# Altium schematic sheet Laboratoire2_MemRTC-I2C-ETU.SchDoc
size Letter; Organization: Cegep Limoilou; Address1: 1300, 8e Avenue; Address2: Québec, QC; Address3: Canada; Address4: G1J 5L5; Revision: A; SheetNumber: 1; SheetTotal: 1; Conception: Conception?; Titre: Laboratoire #2, cours 247-316-LI; Modification: A.C.
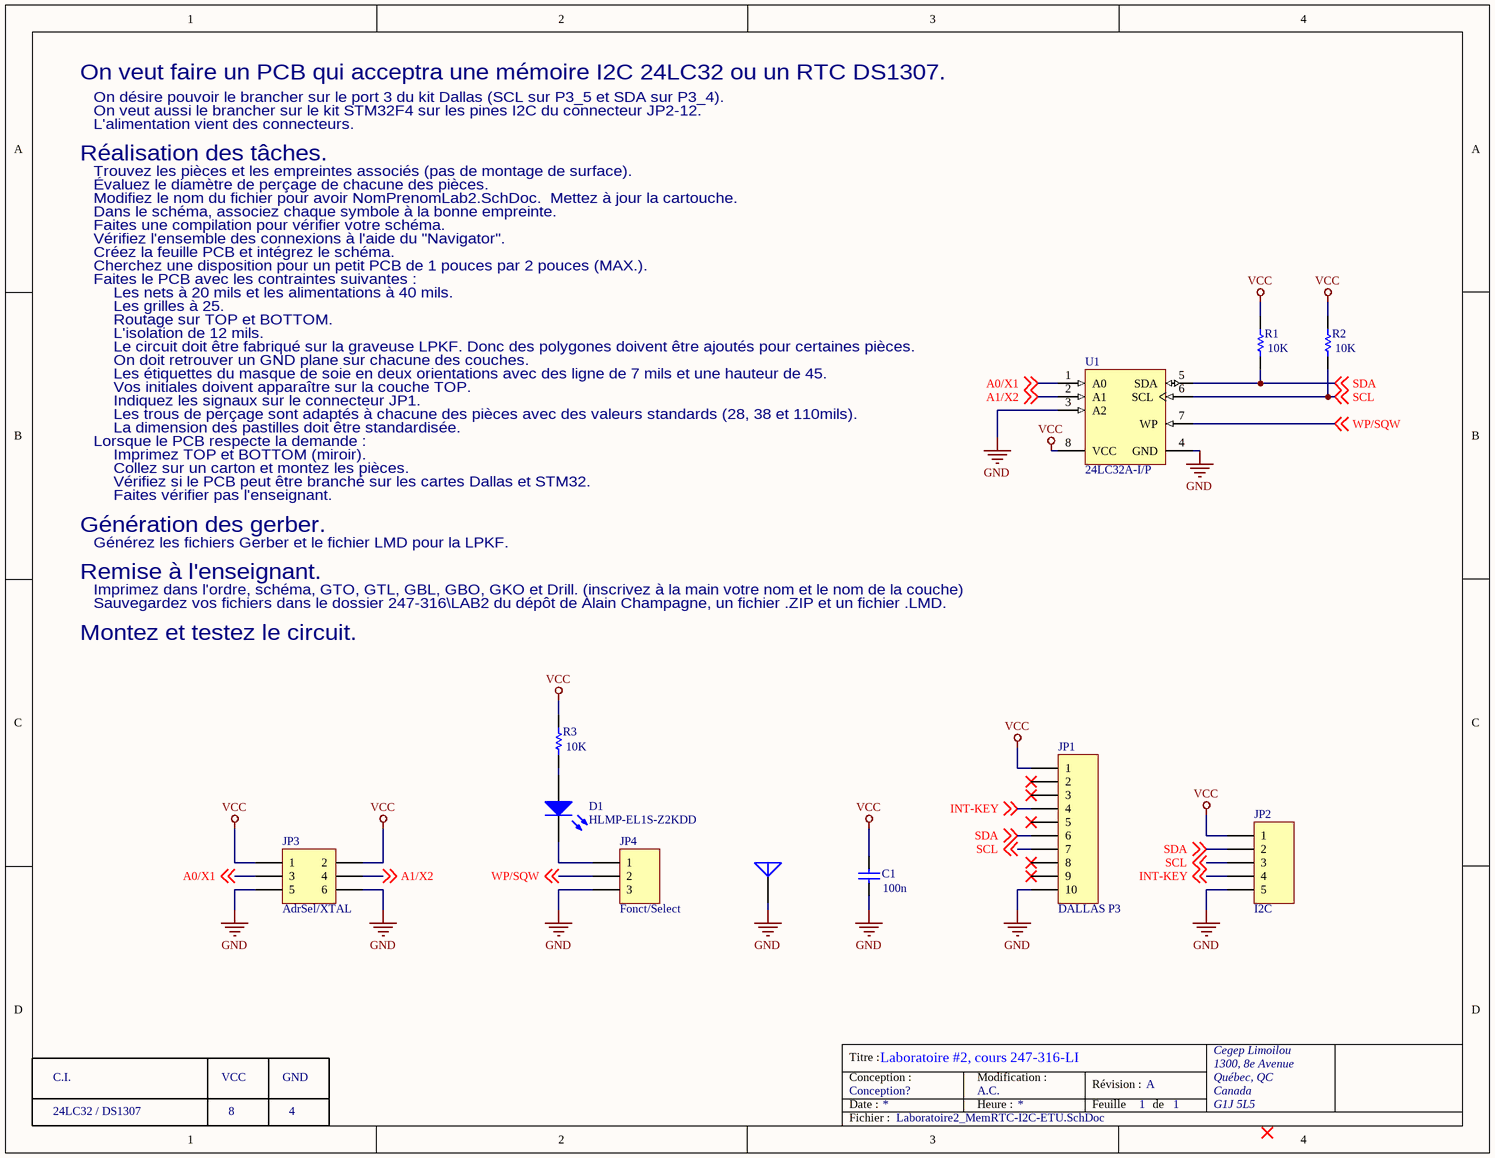
[diagram p0: Laboratoire2_MemRTC-I2C-ETU.SchDoc]

## Parts
C1  100n  [AC100\125_2]
D1  HLMP-EL1S-Z2KDD  [RC100\200+_2]
JP1  DALLAS P3  [SIP\10P_2]
JP2  I2C  [MOLEX5_2]
JP3  AdrSel/XTAL  [J\6P_2]
JP4  Fonct/Select  [SIP\3P_2]
MTH1  Montage  [MTHOLE1]  (value not drawn)
R1  10K  [R400_2]
R2  10K  [R400_2]
R3  10K  [R400_2]
U1  24LC32A-I/P  [DIP8_2]

## Nets
GND: C1.1 JP1.10 JP2.5 JP3.5 JP3.6 JP4.3 MTH1.1(A) U1.3(A2) U1.4(GND)
VCC: C1.2 JP1.1 JP2.1 JP3.1 JP3.2 R1.2 R2.2 R3.2 U1.8(VCC)
A0/X1: JP3.3 U1.1(A0) ; off-sheet A0/X1
A1/X2: JP3.4 U1.2(A1) ; off-sheet A1/X2
INT-KEY: JP1.4 JP2.4 ; off-sheet INT-KEY
SCL: JP1.7 JP2.3 R2.1 U1.6(SCL) ; off-sheet SCL
SDA: JP1.6 JP2.2 R1.1 U1.5(SDA) ; off-sheet SDA
WP/SQW: JP4.2 U1.7(WP) ; off-sheet WP/SQW
NetD1_1: D1.1(A) R3.1
NetD1_2: D1.2(K) JP4.1

Not connected (* = marked no-connect by the designer): JP1 2* 3* 5* 8* 9*

## Notes on the sheet
- On veut faire un PCB qui acceptra une mémoire I2C 24LC32 ou un RTC DS1307.
- On désire pouvoir le brancher sur le port 3 du kit Dallas (SCL sur P3_5 et SDA sur P3_4).
- Réalisation des tâches.
- On veut aussi le brancher sur le kit STM32F4 sur les pines I2C du connecteur JP2-12.
- L'alimentation vient des connecteurs.
- Trouvez les pièces et les empreintes associés (pas de montage de surface).
- Évaluez le diamètre de perçage de chacune des pièces.
- Modifiez le nom du fichier pour avoir NomPrenomLab2.SchDoc.  Mettez à jour la cartouche.
- Dans le schéma, associez chaque symbole à la bonne empreinte.
- Faites une compilation pour vérifier votre schéma.
- Vérifiez l'ensemble des connexions à l'aide du "Navigator".
- Créez la feuille PCB et intégrez le schéma.
- Cherchez une disposition pour un petit PCB de 1 pouces par 2 pouces (MAX.).
- Faites le PCB avec les contraintes suivantes :
- Les nets à 20 mils et les alimentations à 40 mils.
- Les grilles à 25.
- Routage sur TOP et BOTTOM.
- L'isolation de 12 mils.
- Le circuit doit être fabriqué sur la graveuse LPKF. Donc des polygones doivent être ajoutés pour certaines pièces.
- On doit retrouver un GND plane sur chacune des couches.
- Les étiquettes du masque de soie en deux orientations avec des ligne de 7 mils et une hauteur de 45.
- Vos initiales doivent apparaître sur la couche TOP.
- Indiquez les signaux sur le connecteur JP1.
- Les trous de perçage sont adaptés à chacune des pièces avec des valeurs standards (28, 38 et 110mils).
- La dimension des pastilles doit être standardisée.
- Lorsque le PCB respecte la demande :
- Imprimez TOP et BOTTOM (miroir).
- Collez sur un carton et montez les pièces.
- Vérifiez si le PCB peut être branché sur les cartes Dallas et STM32.
- Faites vérifier pas l'enseignant.
- Génération des gerber.
- Générez les fichiers Gerber et le fichier LMD pour la LPKF.
- Remise à l'enseignant.
- Montez et testez le circuit.
- Imprimez dans l'ordre, schéma, GTO, GTL, GBL, GBO, GKO et Drill. (inscrivez à la main votre nom et le nom de la couche)
- Sauvegardez vos fichiers dans le dossier 247-316\LAB2 du dépôt de Alain Champagne, un fichier .ZIP et un fichier .LMD.
- C.I.
- VCC
- GND
- 24LC32 / DS1307
- 8
- 4
- Titre :
- Conception :
- Date :
- Modification :
- Heure :
- Révision :
- Feuille
- de
- Fichier :

## Library data of the parts
C1 = Cap: Capacitor; Value: 100pF; Published: 8-Jun-2000; LatestRevisionDate: 17-Jul-2002; LatestRevisionNote: Re-released for DXP Platform.; PackageReference: RAD-0.3; Publisher: Altium Limited
D1 = LED0: Typical INFRARED GaAs LED; Published: 8-Jun-2000; LatestRevisionDate: 08-Jul-2005; LatestRevisionNote: Mech Layer 1 removed.; PackageReference: LED-0; Publisher: Altium Limited
JP1 = Header 10: Header, 10-Pin; LatestRevisionDate: 17-Jul-2002; LatestRevisionNote: Re-released for DXP Platform.; Publisher: Altium Limited
JP2 = Header 5: Header, 5-Pin; LatestRevisionDate: 17-Jul-2002; LatestRevisionNote: Re-released for DXP Platform.; Publisher: Altium Limited
JP3 = Header 3X2: Header, 3-Pin, Dual row; LatestRevisionDate: 17-Jul-2002; LatestRevisionNote: Re-released for DXP Platform.; Publisher: Altium Limited
JP4 = Header 3: Header, 3-Pin; LatestRevisionDate: 17-Jul-2002; LatestRevisionNote: Re-released for DXP Platform.; Publisher: Altium Limited
MTH1 = Antenna: Generic Antenna; Published: 24-Mar-1999; LatestRevisionDate: 17-Jul-2002; LatestRevisionNote: Re-released for DXP Platform.; PackageReference: PIN1; Publisher: Altium Limited
R1-R3 = Res1: Resistor; Published: 8-Jun-2000; LatestRevisionDate: 17-Jul-2002; LatestRevisionNote: Re-released for DXP Platform.; PackageReference: AXIAL-0.3; Publisher: Altium Limited; PackageDescription: Axial Device, Thru-Hole; 2 Leads; 0.3 in Pin Spacing; Value: 10K
U1 = 24LC32A-I/P: 32Kbit, 400kHz, 2.5V, I2C Serial EEPROM, 8-Pin PDIP, Industrial Temperature; Published: 29-Jan-2009; DatasheetVersion: revH, Feb-2007; PackageVersion: revAW, Oct-2008; PackageReference: PDIP300-P8; Publisher: Altium Limited; PackageDescription: 8-Lead Plastic Dual In-Line (P) - 300 mil Body [PDIP]; Code_JEDEC: MS-001; ComponentLink1Description: Manufacturer Link; ComponentLink1URL: http://www.microchip.com; ComponentLink2Description: Datasheet; ComponentLink2URL: http://ww1.microchip.com/downloads/en/DeviceDoc/21713H.pdf; ComponentLink3Description: Packaging Specification; ComponentLink3URL: http://ww1.microchip.com/downloads/en/PackagingSpec/00049AW.pdf